# Altium schematic sheet SHDN-BSPD-S05-V00-BSPDDelay.SchDoc: RC Charging Delay
size A3; DrawnBy: Jonn Dillon; DocumentNumber: 5; Revision: 01; SheetNumber: 5; SheetTotal: 12
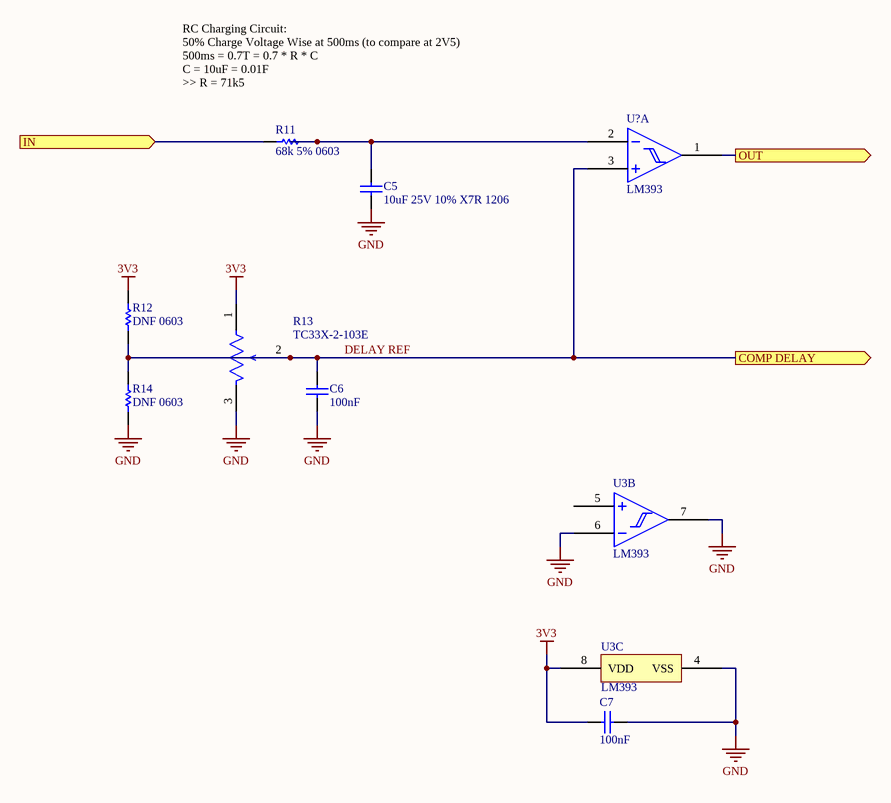
[diagram p0: SHDN-BSPD-S05-V00-BSPDDelay.SchDoc]

## Parts
C5  10uF 25V 10% X7R 1206  [Cap_Ceramic_1206]
C6  100nF  [Cap_Ceramic_0603]
C7  100nF  [Cap_Ceramic_0603]
R11  68k 5% 0603  [Res_ThinFilm_0603]
R12  DNF 0603  [Res_ThinFilm_0603]
R13  TC33X-2-103E
R14  DNF 0603  [Res_ThinFilm_0603]
U3  LM393  [SOIC-8]  (parts B,C of 3)
U?  LM393  [TSSOP-8]  (part A of 3)

## Ports
COMP DELAY (out), IN (in), OUT (out)

## Nets
3V3: C7.2 R12.2 R13.1 U3.8(VDD)
GND: C5.1 C6.1 C7.1 R13.3 R14.1 U3.4(VSS) U3.6(IN2-) U3.7(OUT1)
DELAY REF: C6.2 R12.1 R13.2 R14.2 U?.3(IN1+) ; port COMP DELAY
IN: R11.1 ; port IN
OUT: U?.1(OUT1) ; port OUT
NetC5_2: C5.2 R11.2 U?.2(IN1-)

Not connected (* = marked no-connect by the designer): U3 5(IN2+)

## Notes on the sheet
- RC Charging Circuit:
  50% Charge Voltage Wise at 500ms (to compare at 2V5)
  500ms = 0.7T = 0.7 * R * C
  C = 10uF = 0.01F
  >> R = 71k5
- Revision History:
- Sheet Title:
- Rev
- Date
- Description
- Project:
- Size:
- Drawn By:
- A3
- Number:
- Revision:
- Sheet
- Version:
- of
- QUT Motorsport
- O-120, Gardens Point
- 2 George Street
- Brisbane, QLD 4000
- Australia
- Print Date:
- Print Time:
- File Name:

## Library data of the parts
C5 = 10uF 25V 10% X7R 1206: Capacitor, Ceramic, SMD, 10uF, 25V, 10%, X7R, 1206
C6 C7 = 100nF 50V 5% X7R 0603: Capacitor, Ceramic, SMD, 100nF, 50V, 5%, X7R, 0603
R11 = 68k 5% 0603: Resistor, SMD, 68k, 0.1W, 5%, 0603
R12 R14 = DNF 0603: Resistor, SMD, DNF, 0.1W, 0603
R13 = TC33X-2-103E: 10 kOhms 0.1W, 1/10W J Lead Surface Mount Trimmer Potentiometer Cermet 1 Turn Top Adjustment
U3 U? = LM393: General Purpose Comparitor 2 Circuit 8-SOIC